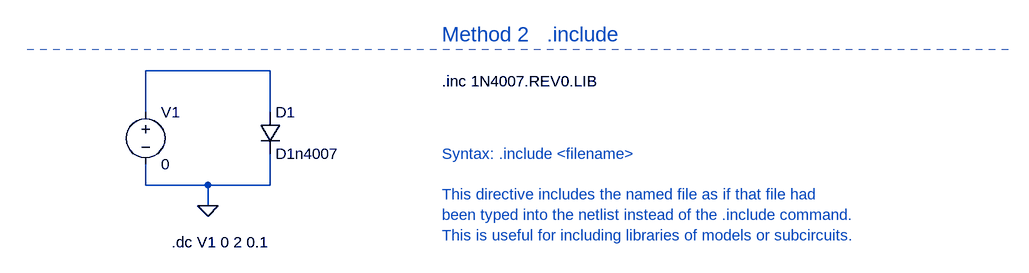
[diagram p0: schematic LTspice 06-1 Import SPICE model_method2 .inc.asc]
LTspice 06-1 Import SPICE model_method2 .inc.asc, the LTspice schematic file:
Version 4
SHEET 1 2548 680
WIRE 832 -208 640 -208
WIRE 640 -144 640 -208
WIRE 832 -144 832 -208
WIRE 640 -32 640 -64
WIRE 736 -32 640 -32
WIRE 832 -32 832 -80
WIRE 832 -32 736 -32
WIRE 736 0 736 -32
FLAG 736 0 0
SYMBOL voltage 640 -160 R0
SYMATTR InstName V1
SYMATTR Value 0
SYMBOL diode 816 -144 R0
SYMATTR InstName D1
SYMATTR Value D1n4007
TEXT 680 56 Left 2 !.dc V1 0 2 0.1
TEXT 1096 -264 Left 3 ;Method 2   .include
TEXT 1096 -192 Left 2 !.inc 1N4007.REV0.LIB
TEXT 1096 -80 Left 2 ;Syntax: .include <filename>\n \nThis directive includes the named file as if that file had \nbeen typed into the netlist instead of the .include command. \nThis is useful for including libraries of models or subcircuits.
LINE Normal 1968 -240 448 -240 2

The netlist it stands for:
* LTspice 06-1 Import SPICE model_method2 .inc.asc
V1 N001 0 0
D1 N001 0 D1n4007
.model D D
.lib standard.dio
.dc V1 0 2 0.1
* Method 2   .include
.inc 1N4007.REV0.LIB
* Syntax: .include <filename>
* This directive includes the named file as if that file had
* been typed into the netlist instead of the .include command.
* This is useful for including libraries of models or subcircuits.
.backanno
.end